# EAGLE design switch-board (EAGLE 7.7.0)
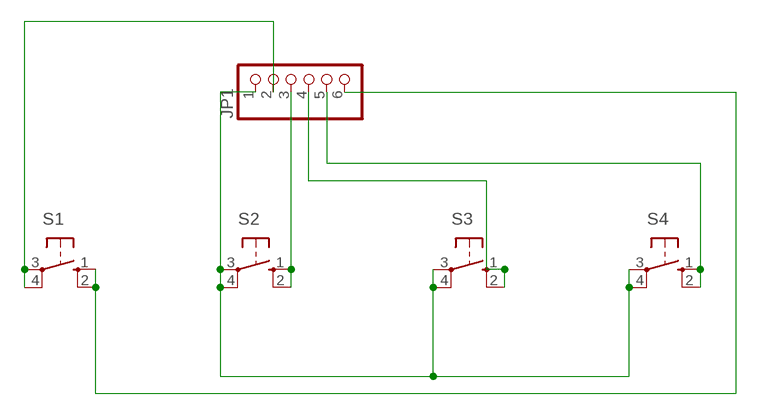
[diagram p0: schematic, sheet 1]

## Parts
JP1  PINHD-1X6  [1X06]
S1  10-XX  [B3F-10XX]
S2  10-XX  [B3F-10XX]
S3  10-XX  [B3F-10XX]
S4  10-XX  [B3F-10XX]

## Nets
N$1: JP1.1 S2.3(P) S2.4(P1) S3.3(P) S3.4(P1) S4.3(P) S4.4(P1)
N$2: JP1.3 S2.1(S) S2.2(S1)
N$3: JP1.4 S3.1(S) S3.2(S1)
N$4: JP1.5 S4.1(S) S4.2(S1)
N$5: JP1.6 S1.1(S) S1.2(S1)
N$6: JP1.2 S1.3(P) S1.4(P1)

## Library data of the parts
JP1 = pinhead:PINHD-1X6: PIN HEADER
S1-S4 = switch-omron:10-XX: OMRON SWITCH; MPN: B3F-1000; OC_FARNELL: 176432; OC_NEWARK: 36M3542

## Board
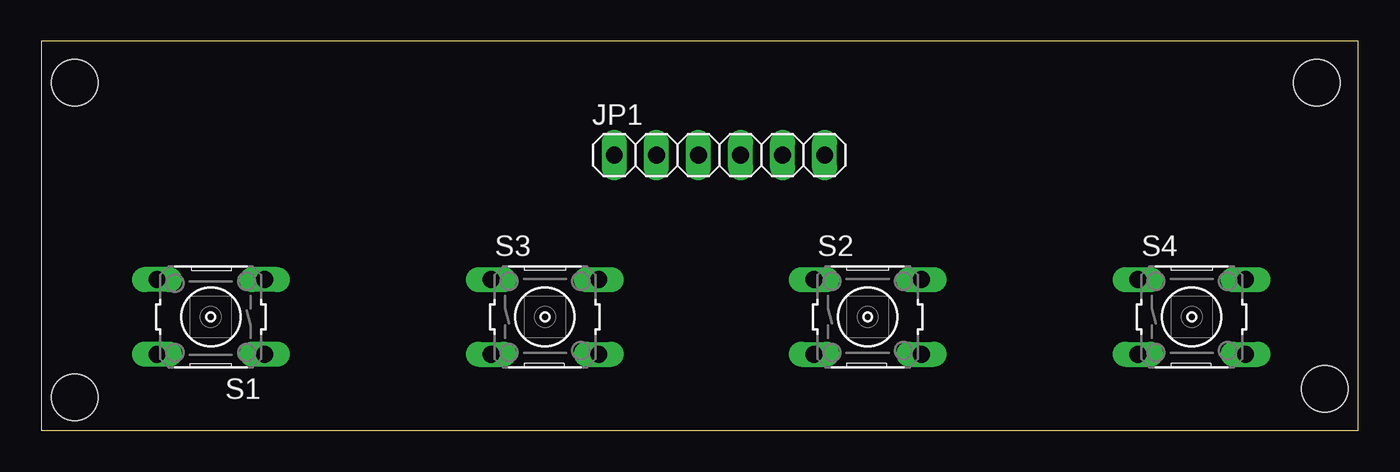
[diagram p1: board, top side]
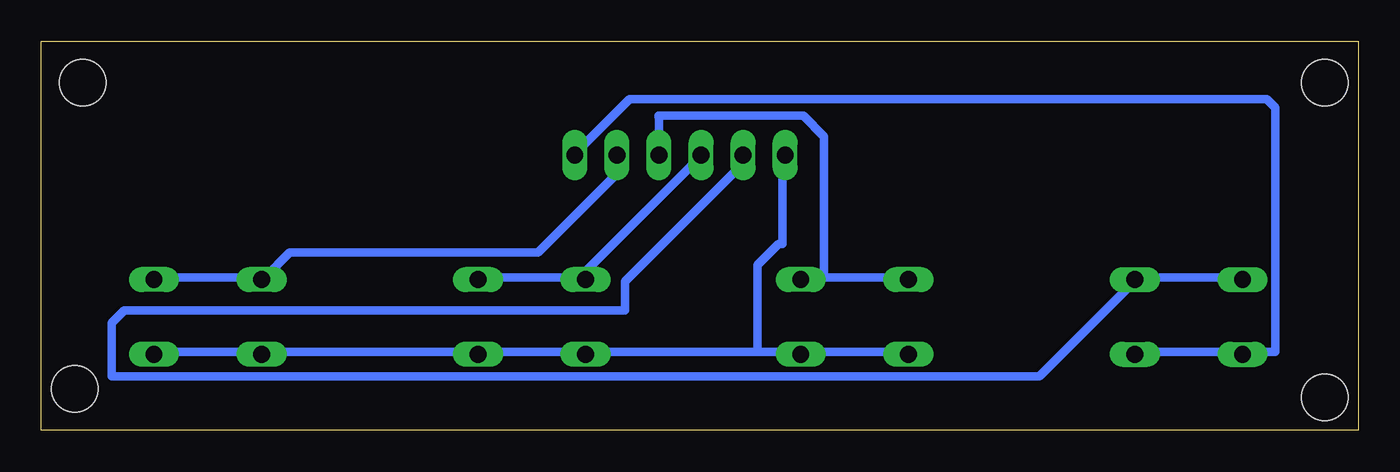
[diagram p2: board, bottom side, seen from below]

Size 79.5 x 23.5 mm. Coordinates in mm from the lower left corner, seen from the top.
Outline: 0,0 79.5,0 79.5,23.5 0,23.5 0,0
Copper layers (1*16): Top 0.035mm / dielectric 1.5mm / Bottom 0.035mm
Design rules "default": minimum track width 10mil, minimum drill 24mil, track to track 8mil, track to pad 8mil, pad to pad 8mil, via to via 8mil, smd to smd 8mil, copper to edge 40mil, drill to drill 8mil, minimum pad ring 10mil, minimum via ring 8mil, stop-mask expansion 4mil, vias tented up to drill 0mil, thermal gap 10mil
Holes 2.8 mm at 77,21 77.5,2.5 2,21 2,2

### Footprints (pad centres in the part's own frame; a part is rotated, then mirrored left to right if it is on the bottom)
1X06 = drill 1.016 long: 1 -6.35,0; 2 -3.81,0; 3 -1.27,0; 4 1.27,0; 5 3.81,0; 6 6.35,0
B3F-10XX = drill 1.016 long: 1 -3.251,2.261; 2 3.251,2.261; 3 -3.251,-2.261; 4 3.251,-2.261

### Placement (x,y rotation side)
JP1  40.94,16.63 0 top
S1  10.23,6.85 180 top
S2  49.89,6.85 0 top
S3  30.4,6.85 0 top
S4  69.45,6.85 0 top

### Tracks (layer width: path | path; a pad name or v marks a point on that pad's centre or on a via)
N$1
  Bottom 0.254: 33.5,4.75 S3.4 33.75,4.75 | 46.5,4.75 S2.3 | 66,4.75 S4.3 | 53.25,4.75 S2.4
  Bottom 0.5: S4.3 66.25,4.75 72.5,4.75 S4.4 | S2.3 46.75,4.75 53,4.75 S2.4 | 33.5,4.75 27.25,4.75 S3.3 | 36.25,4.75 36.25,10 35,11.25 34.75,11.25 34.75,16.5 JP1.1 | 33.75,4.75 36.25,4.75 | 36.25,4.75 46.5,4.75 | 53.25,4.75 66,4.75
N$2
  Bottom 0.254: 47,9.25 46.75,9.25 S2.1
  Bottom 0.5: 47,9.25 53,9.25 S2.2 | 47,9.25 39.75,16.5 JP1.3 | 47,9.25 S2.1
N$3
  Bottom 0.254: 33.5,9.25 32.25,9.25 S3.2
  Bottom 0.5: S3.1 27.25,9.25 32.25,9.25 32.25,17.75 33.5,19 42.25,19 42.21,18.75 JP1.4 | 33.5,9.25 S3.2
N$4
  Bottom 0.254: 66,9.25 S4.1
  Bottom 0.5: S4.1 66.25,9.25 72.5,9.25 S4.2 | 66,9.25 64.5,10.75 49.5,10.75 44.75,15.5 JP1.5
N$5
  Bottom 0.254: 47.25,16.75 JP1.6 | 6.75,4.75 S1.2
  Bottom 0.5: S1.2 7,4.75 13.25,4.75 S1.1 | 47.25,16.75 44,20 5.5,20 5,19.5 5,4.75 6.75,4.75
N$6
  Bottom 0.254: 13.25,9.25 S1.3
  Bottom 0.5: 13.25,9.25 7,9.25 S1.4 | JP1.2 37.25,16 44.25,9 44.25,7.25 74.5,7.25 75.25,6.5 75.25,3.25 19.25,3.25 13.5,9 S1.3